# EAGLE design E93_Piko_51290_21MTC_J1_012_01_04 (EAGLE 5.10)
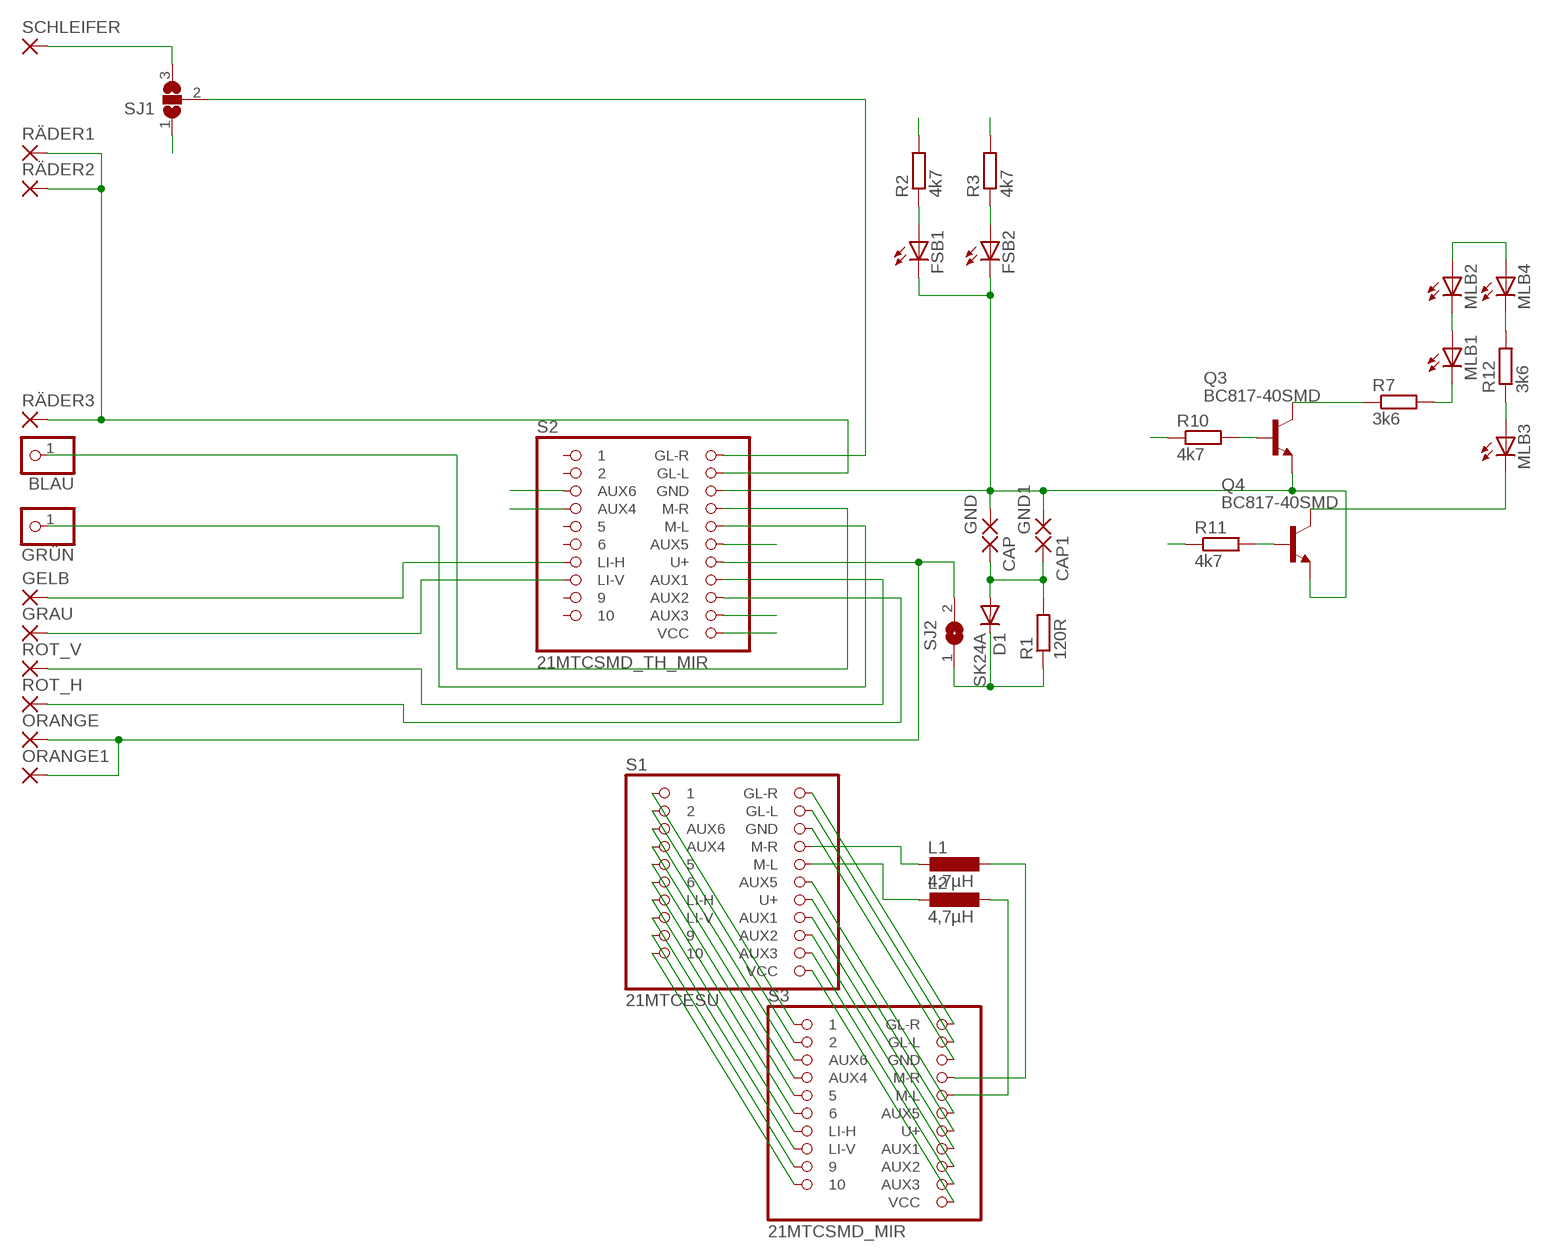
[diagram p0: schematic, sheet 1]

## Parts
BLAU  PINHD-1X1  [1X01]
CAP  SMD2  [SMD1,27-2,54]
CAP1  SMD2  [SMD1,27-2,54]
D1  SK24A  ES2D  [SMB]
FSB1  LEDCHIP-LED0603  [CHIP-LED0603]
FSB2  LEDCHIP-LED0603  [CHIP-LED0603]
GELB  SMD2  [SMD1,27-2,54]
GND  SMD2  [SMD1,27-2,54]
GND1  SMD2  [SMD1,27-2,54]
GRAU  SMD2  [SMD1,27-2,54]
GRÜN  PINHD-1X1  [1X01]
L1  4,7µH  L-EUL1212  [L1212]
L2  4,7µH  L-EUL1212  [L1212]
MLB1  LEDCHIP-LED0603  [CHIP-LED0603]
MLB2  LEDCHIP-LED0603  [CHIP-LED0603]
MLB3  LEDCHIP-LED0603  [CHIP-LED0603]
MLB4  LEDCHIP-LED0603  [CHIP-LED0603]
ORANGE  SMD2  [SMD1,27-2,54]
ORANGE1  SMD2  [SMD1,27-2,54]
Q3  BC817-40SMD  [SOT23-BEC]
Q4  BC817-40SMD  [SOT23-BEC]
R1  120R  R-EU_R0603S  [R0603S]
R2  4k7  R-EU_R0603  [R0603]
R3  4k7  R-EU_R0603  [R0603]
R7  3k6  R-EU_R1206  [R1206]
R10  4k7  R-EU_R0603  [R0603]
R11  4k7  R-EU_R0603  [R0603]
R12  3k6  R-EU_R0603  [R0603]
ROT_H  SMD2  [SMD1,27-2,54]
ROT_V  SMD2  [SMD1,27-2,54]
RÄDER1  SMD2  [SMD1,27-2,54]
RÄDER2  SMD2  [SMD1,27-2,54]
RÄDER3  SMD2  [SMD1,27-2,54]
S1  21MTCESU  [21MTC_SMD_ESU]
S2  21MTCSMD_TH_MIR  [21MTC_SMD_TH_MIR]
S3  21MTCSMD_MIR  [21MTC_SMD_MIR]
SCHLEIFER  SMD2  [SMD1,27-2,54]
SJ1  SJ2W  [SJ_2]
SJ2  SJ"  [SJ]

## Nets
ABNEHMER: SJ1.1
AUX1: ROT_V.1(P) S2.P15(AUX1)
AUX2: ROT_H.1(P) S2.P14(AUX2)
BLAU: BLAU.1 S2.P19(M-R)
F3: R2.2 S2.P13(AUX3)
F4: R10.1 S2.P4(AUX4)
F5: R3.2 S2.P17(AUX5)
F6: R11.1 S2.P3(AUX6)
GND: FSB1.C FSB2.C GND1.1(P) GND.1(P) Q3.E Q4.E S2.P20(GND)
GRAU: GRAU.1(P) S2.P8(LI-V)
GRÜN: GRÜN.1 S2.P18(M-L)
MITTEL: S2.P22(GL-R) SJ1.2
N$1: CAP1.1(P) CAP.1(P) D1.A R1.2
N$2: D1.C R1.1 SJ2.1
N$3: Q3.B R10.2
N$4: Q4.B R11.2
N$5: FSB1.A R2.1
N$6: GELB.1(P) S2.P7(LI-H)
N$7: FSB2.A R3.1
N$8: Q3.C R7.1
N$9: MLB4.C R12.2
N$10: MLB1.C R7.2
N$11: MLB3.A R12.1
N$12: L1.2 S1.P19(M-R)
N$13: L2.2 S1.P18(M-L)
N$14: MLB3.C Q4.C
N$15: L2.1 S3.P18(M-L)
N$16: S1.P1 S3.P1
N$17: S1.P2 S3.P2
N$18: S1.P3(AUX6) S3.P3(AUX6)
N$19: S1.P4(AUX4) S3.P4(AUX4)
N$20: S1.P5 S3.P5
N$21: S1.P6 S3.P6
N$22: S1.P7(LI-H) S3.P7(LI-H)
N$23: S1.P8(LI-V) S3.P8(LI-V)
N$24: S1.P9 S3.P9
N$25: S1.P10 S3.P10
N$26: S1.P12(VCC) S3.P12(VCC)
N$27: S1.P13(AUX3) S3.P13(AUX3)
N$28: S1.P14(AUX2) S3.P14(AUX2)
N$29: S1.P15(AUX1) S3.P15(AUX1)
N$30: S1.P16(U+) S3.P16(U+)
N$31: S1.P17(AUX5) S3.P17(AUX5)
N$32: L1.1 S3.P19(M-R)
N$33: MLB1.A MLB2.C
N$34: S1.P20(GND) S3.P20(GND)
N$35: S1.P21(GL-L) S3.P21(GL-L)
N$36: S1.P22(GL-R) S3.P22(GL-R)
ORANGE: MLB2.A MLB4.A ORANGE1.1(P) ORANGE.1(P) S2.P16(U+) SJ2.2
RÄDER: RÄDER1.1(P) RÄDER2.1(P) RÄDER3.1(P) S2.P21(GL-L)
SCHLEIFER: SCHLEIFER.1(P) SJ1.3
VCC: S2.P12(VCC)
Unconnected: S2.P1 S2.P2 S2.P5 S2.P6 S2.P9 S2.P10

## Library data of the parts
BLAU GRÜN = pinhead:PINHD-1X1: PIN HEADER
CAP CAP1 GELB GND GND1 GRAU ORANGE ORANGE1 ROT_H ROT_V RÄDER1-RÄDER3 SCHLEIFER = wirepad:SMD2: SMD PAD
D1 = diode:ES2D: DIODE super fast rectifier, 2 A
FSB1 FSB2 MLB1-MLB4 = led:LED: LED OSRAM: - CHIPLED LG R971, LG N971, LY N971, LG Q971, LY Q971, LO R971, LY R971 LH N974, LH R974 LS Q976, LO Q976, LY Q976 LO Q996 - Hyper CHIPLED LW Q18S LB Q993, LB Q99A, LB R99A - SideLED LS A670, LO A670, LY A670, LG A670, LP A670 LB A673, LV A673, LT A673, LW A673 LH A674 LY A675 LS A676, LA A676, LO A676, LY A676, LW A676 LS A679, LY A679, LG A679 - Hyper Micro SIDELED® LS Y876, LA Y876, LO Y876, LY Y876 LT Y87S - SmartLED LW L88C, LW L88S LB L89C, LB L89S, LG L890 LS L89K, LO L89K, LY L89K LS L896, LA L896, LO L896, LY L896 - TOPLED LS T670, LO T670, LY T670, LG T670, LP T670 LSG T670, LSP T670, LSY T670, LOP T670, LYG T670 LG T671, LOG T671, LSG T671 LB T673, LV T673, LT T673, LW T673 LH T674 LS T676, LA T676, LO T676, LY T676, LB T676, LH T676, LSB T676, LW T676 LB T67C, LV T67C, LT T67C, LS T67K, LO T67K, LY T67K, LW E67C LS E67B, LA E67B, LO E67B, LY E67B, LB E67C, LV E67C, LT E67C LW T67C LS T679, LY T679, LG T679 LS T770, LO T770, LY T770, LG T770, LP T770 LB T773, LV T773, LT T773, LW T773 LH T774 LS E675, LA E675, LY E675, LS T675 LS T776, LA T776, LO T776, LY T776, LB T776 LHGB T686 LT T68C, LB T68C - Hyper Mini TOPLED® LB M676 - Mini TOPLED Santana® LG M470 LS M47K, LO M47K, LY M47K Source: http://www.osram.convergy.de LUXEON: - LUMILED® LXK2-PW12-R00, LXK2-PW12-S00, LXK2-PW14-U00, LXK2-PW14-V00 LXK2-PM12-R00, LXK2-PM12-S00, LXK2-PM14-U00 LXK2-PE12-Q00, LXK2-PE12-R00, LXK2-PE12-S00, LXK2-PE14-T00, LXK2-PE14-U00 LXK2-PB12-K00, LXK2-PB12-L00, LXK2-PB12-M00, LXK2-PB14-N00, LXK2-PB14-P00, LXK2-PB14-Q00 LXK2-PR12-L00, LXK2-PR12-M00, LXK2-PR14-Q00, LXK2-PR14-R00 LXK2-PD12-Q00, LXK2-PD12-R00, LXK2-PD12-S00 LXK2-PH12-R00, LXK2-PH12-S00 LXK2-PL12-P00, LXK2-PL12-Q00, LXK2-PL12-R00 Source: www.luxeon.com KINGBRIGHT: KA-3528ASYC Source: www.kingbright.com
L1 L2 = rcl:L-EU: INDUCTOR, European symbol
Q3 Q4 = transistor-npn:BC817*: NPN Transistor
R1-R3 R7 R10-R12 = rcl:R-EU_: RESISTOR, European symbol
S1-S3 = pinhead:21MTC
SJ1 = jumper:SJ2W: SMD solder JUMPER
SJ2 = jumper:SJ: SMD solder JUMPER

## Board
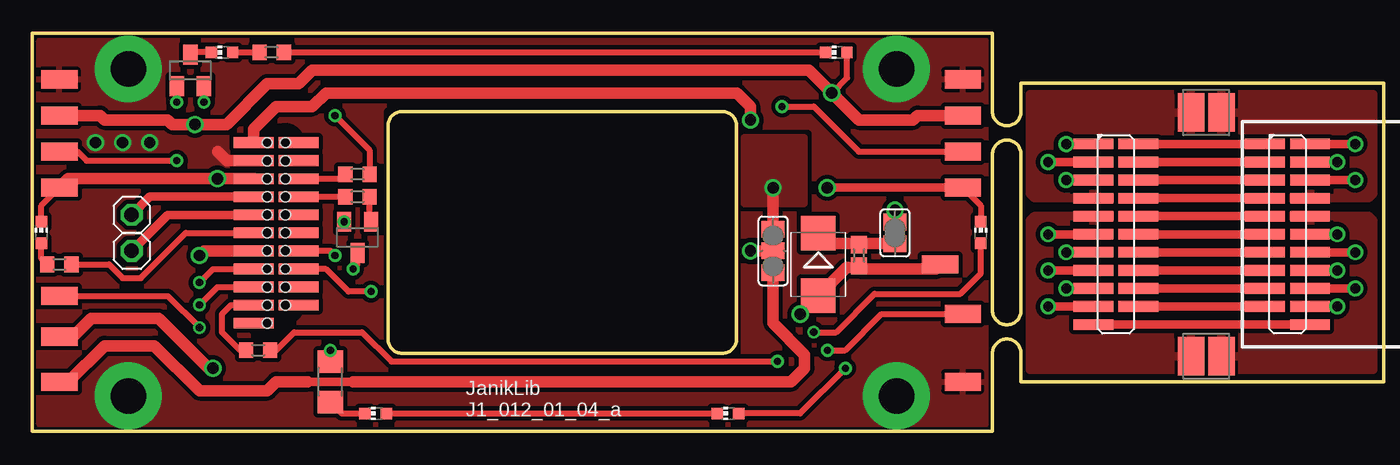
[diagram p1: board, top side]
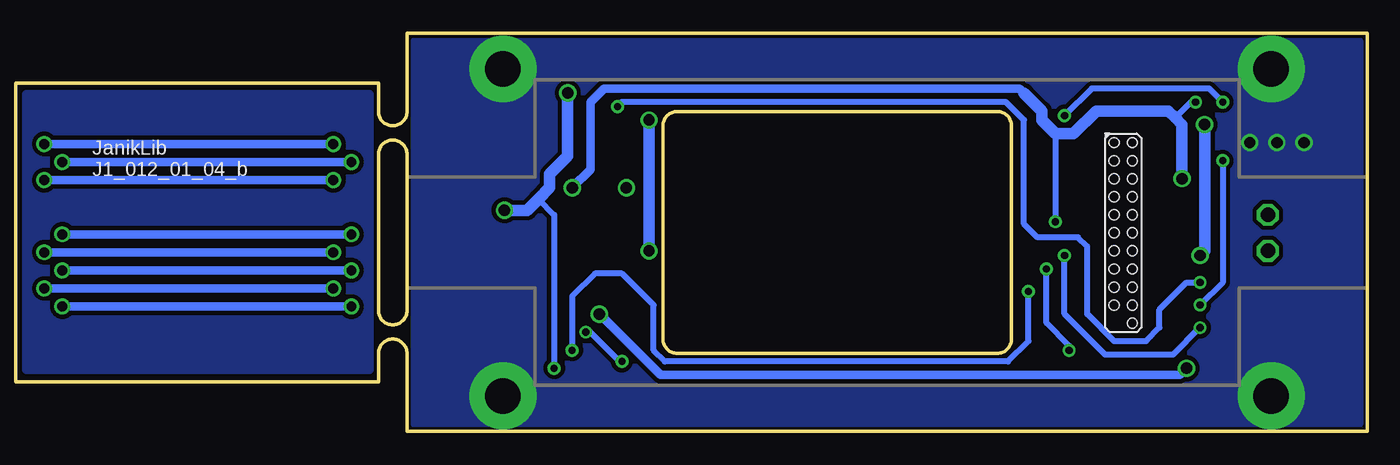
[diagram p2: board, bottom side, seen from below]

No outline drawn. Coordinates in mm, seen from the top.
Copper layers (1*16): Top 0.035mm / dielectric 1.5mm / Bottom 0.035mm
Design rules "default *": minimum track width 10mil, minimum drill 0.6mm, track to track 8mil, track to pad 8mil, pad to pad 8mil, via to via 8mil, smd to smd 8mil, copper to edge 40mil, drill to drill 8mil, minimum pad ring 10mil, minimum via ring 8mil, stop-mask expansion 4mil, vias tented up to drill 0mil, thermal gap 10mil
bKeepout: area 0,17.9 to 9,28; area 0,0 to 9,10.1; area 9,24.8 to 58.5,28; area 9,0 to 58.5,3.2; area 58.5,17.9 to 67.5,28; area 58.5,0 to 67.5,10.1
tRestrict: area 25,5.5 to 49.5,22.5
bRestrict: area 25,5.5 to 49.5,22.5
Milling: 28 lines

### Footprints (pad centres in the part's own frame; a part is rotated, then mirrored left to right if it is on the bottom)
1X01 = drill 1.016 octagon: 1 0,0
SMD1,27-2,54 = smd 1.27 x 2.54: 1 0,0
SMB = smd 2.4 x 2.4: A 2.2,0; C -2.2,0
CHIP-LED0603 = smd 0.8 x 0.8: A 0,-0.75; C 0,0.75
L1212 = smd 1.85 x 2.7: 1 -1.075,0; 2 1.075,0
SOT23-BEC = smd 1 x 1.4: B -0.95,-1.1; C 0,1.1; E 0.95,-1.1
R0603S = smd 1.2 x 1.1: 1 -0.75,0; 2 0.75,0
R0603 = smd 1 x 1.1: 1 -0.85,0; 2 0.85,0
R1206 = smd 1.6 x 1.803: 1 -1.422,0; 2 1.422,0
21MTC_SMD_ESU = smd 0.75 x 2.8: P1 -6.35,-0.953; P2 -5.08,-0.953; P3 -3.81,-0.953; P4 -2.54,-0.953; P5 -1.27,-0.953; P6 0,-0.953; P7 1.27,-0.953; P8 2.54,-0.953; P9 3.81,-0.953; P10 5.08,-0.953; P12 6.35,2.223; P13 5.08,2.223; P14 3.81,2.223; P15 2.54,2.223; P16 1.27,2.223; P17 0,2.223; P18 -1.27,2.223; P19 -2.54,2.223; P20 -3.81,2.223; P21 -5.08,2.223; P22 -6.35,2.223
21MTC_SMD_TH_MIR = smd 0.75 x 2.8 bottom: P1 -6.35,-0.953; P2 -5.08,-0.953; P3 -3.81,-0.953; P4 -2.54,-0.953; P5 -1.27,-0.953; P6 0,-0.953; P7 1.27,-0.953; P8 2.54,-0.953; P9 3.81,-0.953; P10 5.08,-0.953; P12 6.35,2.223; P13 5.08,2.223; P14 3.81,2.223; P15 2.54,2.223; P16 1.27,2.223; P17 0,2.223; P18 -1.27,2.223; P19 -2.54,2.223; P20 -3.81,2.223; P21 -5.08,2.223; P22 -6.35,2.223 | hole 0.7: -6.35,1.27; -5.08,1.27; -3.81,1.27; -2.54,1.27; -1.27,1.27; 0,1.27; 1.27,1.27; 2.54,1.27; 3.81,1.27; 5.08,1.27; 6.35,1.27; 5.08,0; 3.81,0; 2.54,0; 1.27,0; 0,0; -1.27,0; -2.54,0; -3.81,0; -5.08,0; -6.35,0
21MTC_SMD_MIR = smd 0.75 x 2.8: P1 -6.35,2.223; P2 -5.08,2.223; P3 -3.81,2.223; P4 -2.54,2.223; P5 -1.27,2.223; P6 0,2.223; P7 1.27,2.223; P8 2.54,2.223; P9 3.81,2.223; P10 5.08,2.223; P12 6.35,-0.953; P13 5.08,-0.953; P14 3.81,-0.953; P15 2.54,-0.953; P16 1.27,-0.953; P17 0,-0.953; P18 -1.27,-0.953; P19 -2.54,-0.953; P20 -3.81,-0.953; P21 -5.08,-0.953; P22 -6.35,-0.953
SJ_2 = smd 1.168 x 1.6: 1 -1.524,0; 2 0,0; 3 1.524,0
SJ = smd 1.168 x 1.6: 1 -0.762,0; 2 0.762,0

### Placement (x,y rotation side)
BLAU  6.99,15.24 0 top
CAP  63.82,11.75 90 top
CAP1  1.91,6.67 90 top
D1  55.24,11.75 270 top
FSB1  66.67,14 0 top
FSB2  0.64,14 0 top
GELB  1.91,9.53 90 top
GND  65.41,17.14 90 top
GND1  1.91,17.14 90 top
GRAU  65.41,8.26 90 top
GRÜN  6.99,12.7 0 top
L1  82.52,22.44 0 top
L2  82.52,5.3 0 top
MLB1  24.13,1.27 90 top
MLB2  48.9,1.27 90 top
MLB3  13.34,26.67 90 top
MLB4  56.52,26.67 90 top
ORANGE  65.41,22.23 90 top
ORANGE1  1.91,22.23 90 top
Q3  22.86,13.65 180 top
Q4  11.11,25.4 0 top
R1  58.1,12.38 270 top
R2  15.88,5.72 180 top
R3  1.91,11.75 0 top
R7  20.95,3.49 270 top
R10  22.86,16.51 0 top
R11  22.86,18.1 0 top
R12  16.83,26.67 0 top
ROT_H  1.91,19.68 90 top
ROT_V  65.41,19.68 90 top
RÄDER1  1.91,24.77 90 top
RÄDER2  65.41,24.77 90 top
RÄDER3  65.41,3.49 90 top
S1  87.6,13.87 270 top
S2  17.78,13.97 270 bottom
S3  75.53,13.87 270 top
SCHLEIFER  1.91,3.49 90 top
SJ1  52.07,12.7 270 top
SJ2  60.64,13.97 90 top

### Tracks (layer width: path | path; a pad name or v marks a point on that pad's centre or on a via)
ABNEHMER  (via drill 0.8)
  Top 0.813: SJ1.1 v52.07,17.14
  pour Top: 54.3,16 54.3,20.7 50,20.7 50,16
AUX1  (via drill 0.5)
  Top 0.406: S2.P15 12.7,11.43 v11.75,10.48 | ROT_V.1 58.1,19.68 54.93,22.86 v52.7,22.86
  Bottom 0.406: v11.75,10.48 12.7,10.48 14.61,8.57 14.61,7.3 15.56,6.35 17.78,6.35 19.68,8.26 19.68,13.02 20.32,13.65 23.18,13.65 24.13,14.61 24.13,21.91 25.4,23.18 52.39,23.18 v52.7,22.86
AUX2  (via drill 0.5)
  Top 0.406: v11.75,8.89 13.02,10.16 S2.P14 | v10.16,19.05 3.81,19.05 3.17,19.68 ROT_H.1
  Bottom 0.406: v10.16,19.05 10.16,10.48 v11.75,8.89
BLAU
  Top 0.61: S2.P19 8.26,16.51 BLAU.1
F3
  Top 0.406: S2.P13 13.97,8.89 13.34,8.26 13.34,6.99 14.61,5.71 R2.2
F4
  Top 0.406: S2.P4 R10.1
F5
  Top 0.406: R3.2 5.4,11.75 6.35,10.79 7.62,10.79 10.79,13.97 S2.P17
F6
  Top 0.406: S2.P3 21.69,17.78 R11.1
GND  (via drill 0.5, 0.8)
  Top 0.406: GND1.1 0.64,15.88 FSB2.C | GND.1 66.67,15.88 FSB1.C | v12.06,23.18 Q4.E
  Top 0.61: v55.88,17.14 GND.1
  Top 0.813: GND1.1 2.54,17.78 v13.02,17.78 S2.P20
  Bottom 0.406: Q3.E 21.91,15.7 21.91,20.95 | v12.06,23.18 12.38,23.18 13.49,22.07
  Bottom 0.61: v55.88,17.14 54.61,18.41 54.61,23.18 53.66,24.13 24.45,24.13 24.13,23.81
  Bottom 0.813: v13.02,17.78 13.02,21.59 13.49,22.07 13.97,22.54 19.05,22.54 20.64,20.95 21.91,20.95 22.86,21.91 22.86,22.54 24.13,23.81
  other vias: 21.91,14.75
GRAU  (via drill 0.5)
  Top 0.406: S2.P8 20.64,11.43 22.23,9.84 v23.81,9.84 | GRAU.1 59.69,8.26 57.15,5.71 v55.88,5.71
  Bottom 0.406: v23.81,9.84 23.81,6.35 25.24,4.92 49.37,4.92 50.16,5.71 50.16,8.89 52.39,11.11 54.29,11.11 55.88,9.53 v55.88,5.71
GRÜN
  Top 0.61: S2.P18 9.53,15.24 GRÜN.1
MITTEL  (via drill 0.8)
  Top 0.813: S2.P22 15.56,21.27 17.14,22.86 19.68,22.86 20.64,23.81 49.53,23.81 50.48,22.86 v50.48,21.91 | v50.48,12.7 SJ1.2
  Bottom 0.813: v50.48,21.91 v50.48,12.7
N$1  (via drill 0.8)
  Top 0.813: CAP.1 63.5,11.43 58.3,11.43 R1.2 58,11.53 57.23,11.53 D1.A v53.98,8.26 | v12.7,4.45 12.38,4.45 8.89,7.94 4.13,7.94 2.86,6.67 CAP1.1
  Bottom 0.61: v53.98,8.26 49.69,3.97 13.18,3.97 v12.7,4.45
N$2
  Top 0.813: D1.C 55.96,13.23 58,13.23 R1.1 58.18,13.21 SJ2.1
N$3
  Top 0.406: R10.2 23.71,14.85 Q3.B
N$4  (via drill 0.5)
  Top 0.406: R11.2 23.71,19.79 v21.27,22.23 | v10.16,23.18 Q4.B
  Bottom 0.406: v21.27,22.23 19.37,24.13 11.11,24.13 v10.16,23.18
N$5  (via drill 0.5)
  Top 0.406: FSB1.A 66.67,11.11 65.24,9.68 59.21,9.68 56.52,6.99 v54.93,6.99 | R2.1 17.14,5.71 18.41,6.99 23.18,6.99 25.24,4.92 v52.39,4.92
  Bottom 0.406: v52.39,4.92 52.55,4.92 54.61,6.99 v54.93,6.99
N$6  (via drill 0.5)
  Top 0.406: GELB.1 9.53,9.53 v11.75,7.3 | v21.27,12.38 20.95,12.7 S2.P7
  Bottom 0.406: v11.75,7.3 13.65,5.4 18.41,5.4 21.27,8.26 v21.27,12.38
N$7
  Top 0.406: R3.1 0.64,12.17 FSB2.A
N$8  (via drill 0.5)
  Top 0.406: R7.1 v20.95,5.71 | v22.54,11.43 22.86,11.75 Q3.C
  Bottom 0.406: v20.95,5.71 20.95,6.03 22.54,7.62 v22.54,11.43
N$9
  Top 0.406: R12.2 MLB4.C
N$10
  Top 0.406: MLB1.C 21.76,1.27 R7.2
N$11
  Top 0.406: MLB3.A R12.1
N$12
  pour Top (isolate 0.305): 83.15,16.73 83.15,23.39 83.47,23.71 94.27,23.71 94.27,16.73 93.95,16.41 83.47,16.41
N$13
  pour Top (isolate 0.305): 83.15,4.66 83.15,14.82 83.47,15.14 93.95,15.14 94.27,14.82 94.27,4.34 83.47,4.34
N$14
  Top 0.406: MLB3.C 11.28,26.67 Q4.C
N$15
  pour Top (isolate 0.305): 81.88,4.66 81.88,14.82 81.56,15.14 70.45,15.14 70.14,14.82 70.14,4.34 81.56,4.34
N$16
  Top 0.61: S3.P1 S1.P1
N$17
  Top 0.61: S3.P2 S1.P2
N$18
  Top 0.61: S3.P3 S1.P3
N$19
  Top 0.61: S3.P4 S1.P4
N$20
  Top 0.61: S3.P5 S1.P5
N$21
  Top 0.61: S3.P6 S1.P6
N$22
  Top 0.61: S3.P7 S1.P7
N$23
  Top 0.61: S3.P8 S1.P8
N$24
  Top 0.61: S3.P9 S1.P9
N$25
  Top 0.61: S3.P10 S1.P10
N$26
  Top 0.61: S3.P12 S1.P12
N$27  (via drill 0.7)
  Top 0.61: v91.72,8.79 S1.P13 | v71.41,8.79 S3.P13
  Bottom 0.61: v71.41,8.79 v91.72,8.79
N$28  (via drill 0.7)
  Top 0.61: v72.67,10.06 S3.P14 | v93,10.06 S1.P14
  Bottom 0.61: v72.67,10.06 v93,10.06
N$29  (via drill 0.7)
  Top 0.61: v71.41,11.33 S3.P15 | v91.72,11.33 S1.P15
  Bottom 0.61: v71.41,11.33 v91.72,11.33
N$30  (via drill 0.7)
  Top 0.61: v72.67,12.6 S3.P16 | v93,12.6 S1.P16
  Bottom 0.61: v72.67,12.6 v93,12.6
N$31  (via drill 0.7)
  Top 0.61: v91.72,13.87 S1.P17 | v71.41,13.87 S3.P17
  Bottom 0.61: v71.41,13.87 v91.72,13.87
N$32
  pour Top (isolate 0.305): 81.56,23.71 70.14,23.71 70.14,16.73 70.45,16.41 81.56,16.41 81.88,16.73 81.88,23.39
N$33
  Top 0.406: MLB1.A MLB2.C
N$34  (via drill 0.7)
  Top 0.61: v93,17.68 S1.P20 | v72.67,17.68 S3.P20
  Bottom 0.61: v72.67,17.68 v93,17.68
N$35  (via drill 0.7)
  Top 0.61: v91.72,18.95 S1.P21 | v71.41,18.95 S3.P21
  Bottom 0.61: v71.41,18.95 v91.72,18.95
N$36  (via drill 0.7)
  Top 0.61: v93,20.22 S1.P22 | v72.67,20.22 S3.P22
  Bottom 0.61: v72.67,20.22 v93,20.22
N$37
  Top 0.406: 20.95,5.08 20.95,5.4
N$38
  pour Bottom (isolate 0.305): 70.14,23.71 70.14,4.34 94.27,4.34 94.27,23.71
ORANGE  (via drill 0.5, 0.8)
  Top 0.406: MLB4.A 57.27,24.88 v56.2,23.81 | MLB2.A 53.98,1.27 v57.15,4.45
  Top 0.813: S2.P16 12.06,12.7 v11.75,12.38 | ORANGE1.1 4.76,22.23 5.08,21.91 9.53,21.91 9.84,21.59 v11.43,21.59 13.65,21.59 16.51,24.45 18.73,24.45 19.68,25.4 54.61,25.4 v56.2,23.81 58.1,21.91 61.91,21.91 62.23,22.23 ORANGE.1 | v60.64,15.56 SJ2.2
  Bottom 0.406: v57.15,4.45 57.15,15.24 58.26,16.35
  Bottom 0.813: v11.75,12.38 11.43,12.7 v11.43,21.59 | v56.2,23.81 56.2,19.37 57.47,18.1 57.47,17.14 58.26,16.35 59.05,15.56 v60.64,15.56
RÄDER  (via drill 0.8, 2.5 pad 4.7)
  Top 0.813: S2.P21 13.65,19.05 13.02,19.68
  other vias: 6.75,2.5 6.75,25.5 60.75,25.5 60.75,2.5 6.35,20.32 8.26,20.32 4.45,20.32
  pour Bottom (isolate 0.305, rank 2): 67,27.5 0.5,27.5 0.5,0.5 67,0.5
  pour Top (isolate 0.305, rank 2): 0.5,27.5 67,27.5 67,0.5 0.5,0.5
SCHLEIFER
  Top 0.61: 19.37,3.49 22.54,3.49
  Top 0.813: SJ1.3 52.07,7.62 54.29,5.4 54.29,4.45 53.34,3.49 22.54,3.49 | 19.37,3.49 17.14,3.49 16.51,2.86 11.75,2.86 8.57,6.03 5.08,6.03 2.54,3.49 SCHLEIFER.1

### Text on the board
tNames: JanikLib | J1_012_01_04_a
bNames: JanikLib | J1_012_01_04_b
tStop: E93 21MTC | H | V | E93 21MTC
bStop: für Piko 51290 | rad | rad | plus | plus | für Piko 51290 | rot | rot | GMD | gnd | C+ | weiss | weiss | C+ | design by Janik Merz | schl | rad | design by Janik Merz